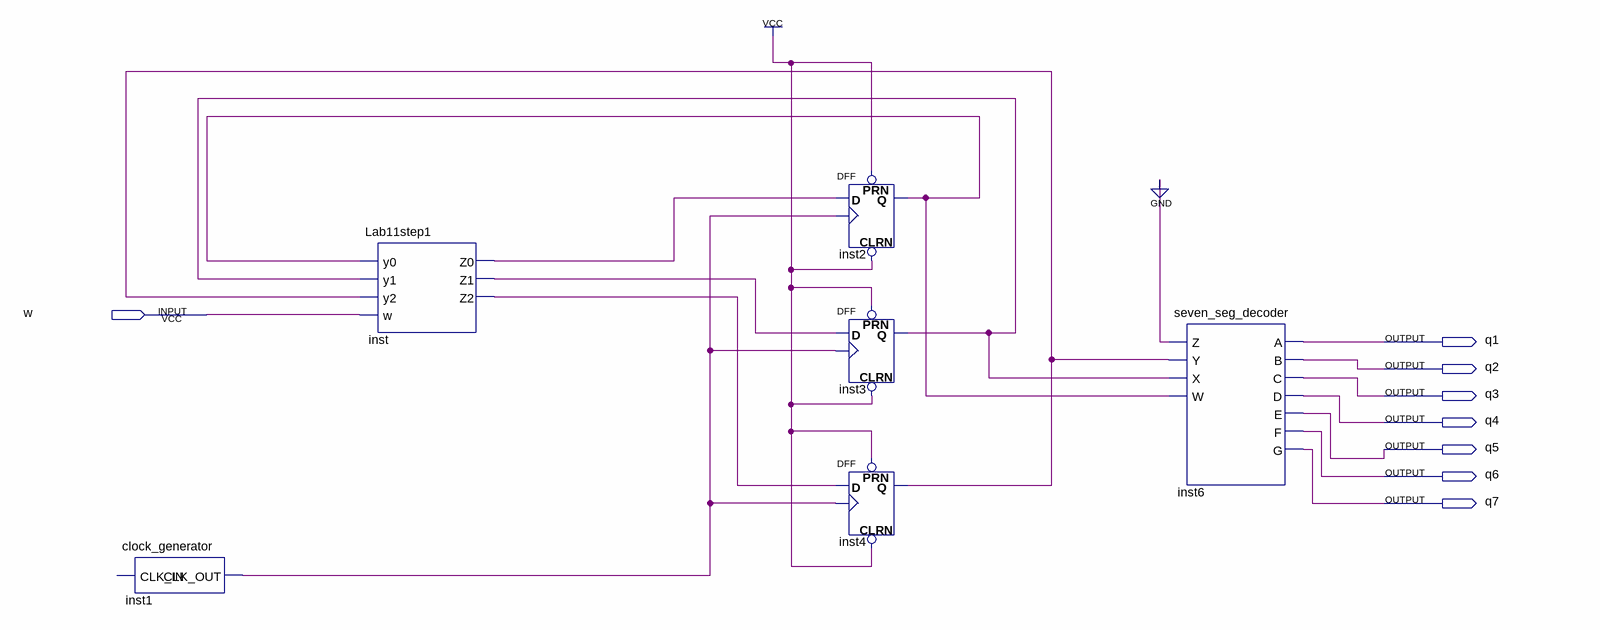
[diagram p0: schematic sheet]
// Quartus schematic lab11step1.bdf as structural Verilog: 6 symbols, 8 pins
module lab11step1 (
  input  w,
  output q1,
  output q2,
  output q3,
  output q4,
  output q5,
  output q6,
  output q7
);

  wire inst1_clk_out, inst2_q, inst3_q, inst4_q, inst_z0, inst_z1, inst_z2;

  clock_generator inst1 (.CLK_OUT(inst1_clk_out));  // open: CLK_IN
  Lab11step1 inst (.y0(inst2_q), .y1(inst3_q), .y2(inst4_q), .w(w), .Z0(inst_z0), .Z1(inst_z1), .Z2(inst_z2));
  DFF inst2 (.CLRN(1'b1), .CLK(inst1_clk_out), .D(inst_z0), .PRN(1'b1), .Q(inst2_q));
  DFF inst3 (.CLRN(1'b1), .CLK(inst1_clk_out), .D(inst_z1), .PRN(1'b1), .Q(inst3_q));
  DFF inst4 (.CLRN(1'b1), .CLK(inst1_clk_out), .D(inst_z2), .PRN(1'b1), .Q(inst4_q));
  seven_seg_decoder inst6 (
    .Z(1'b0), .Y(inst4_q), .X(inst3_q), .W(inst2_q), .A(q1), .B(q2), .C(q3), .D(q4), .E(q5), .F(q6), .G(q7));
endmodule
